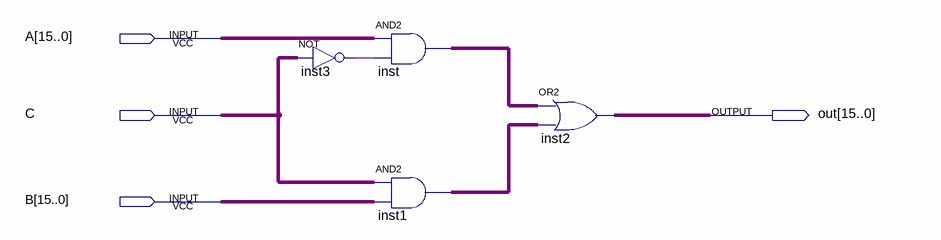
[diagram p0: schematic sheet]
// Quartus schematic selecter.bdf as structural Verilog: 4 symbols, 4 pins
module selecter (
  input  [15:0] A,
  input  C,
  input  [15:0] B,
  output [15:0] out
);

  wire inst3_out;
  wire [15:0] inst1_out, inst_out, undriven;

  assign inst3_out = ~undriven;  // NOT inst3, 16 bits wide
  assign inst_out = A & {16{inst3_out}};  // AND2 inst, 16 bits wide
  assign inst1_out = undriven & B;  // AND2 inst1, 16 bits wide
  assign out = inst_out | inst1_out;  // OR2 inst2, 16 bits wide
endmodule
